# EAGLE design Display Board V1 (EAGLE 9.5.2)
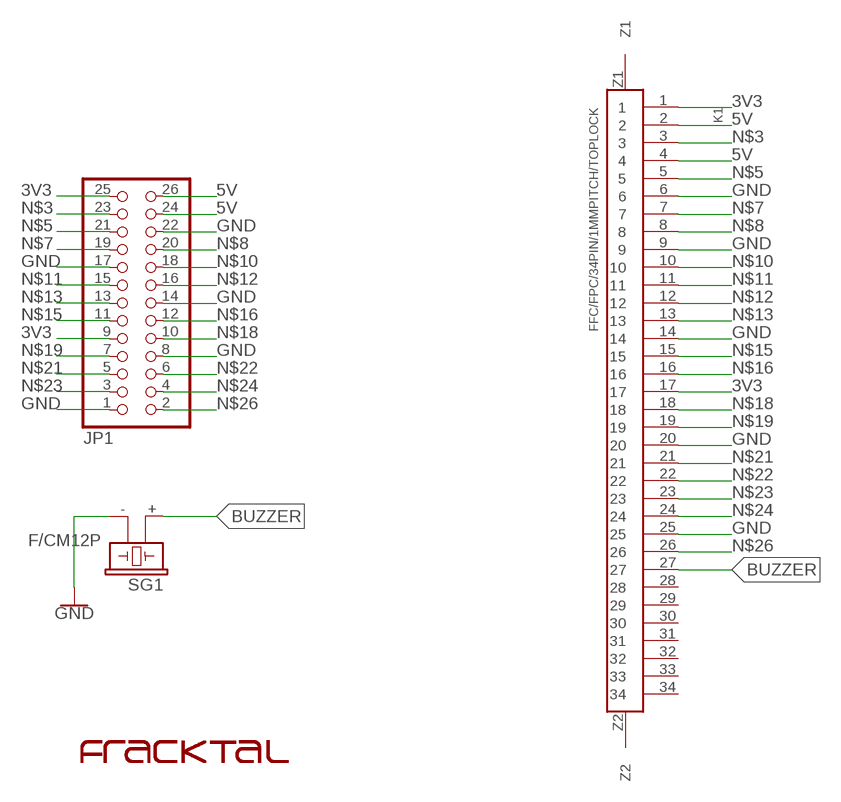
[diagram p0: schematic, sheet 1]

## Parts
JP1  PINHD-2X13  [2X13]
K1  FFC/FPC/34PIN/1MMPITCH/TOPLOCK  [FFC/FPC/34PIN/1MMPITCH/TOPLOCK]
SG1  F/CM12P  [F/CM12P]
U$1  FRACKTALLOGO  [FRACKTALLOGO]

## Nets
3V3: JP1.9 JP1.25 K1.1 K1.17
5V: JP1.24 JP1.26 K1.2 K1.4
BUZZER: K1.27 SG1.+
GND: JP1.1 JP1.8 JP1.14 JP1.17 JP1.22 K1.6 K1.9 K1.14 K1.20 K1.25 SG1.-
N$3: JP1.23 K1.3
N$5: JP1.21 K1.5
N$7: JP1.19 K1.7
N$8: JP1.20 K1.8
N$10: JP1.18 K1.10
N$11: JP1.15 K1.11
N$12: JP1.16 K1.12
N$13: JP1.13 K1.13
N$15: JP1.11 K1.15
N$16: JP1.12 K1.16
N$18: JP1.10 K1.18
N$19: JP1.7 K1.19
N$21: JP1.5 K1.21
N$22: JP1.6 K1.22
N$23: JP1.3 K1.23
N$24: JP1.4 K1.24
N$26: JP1.2 K1.26
Unconnected: K1.28 K1.29 K1.30 K1.31 K1.32 K1.33 K1.34 K1.Z1 K1.Z2

## Library data of the parts
JP1 = pinhead:PINHD-2X13: PIN HEADER
K1 = FracktalWorks:FFC/FPC/34PIN/1MMPITCH/TOPLOCK
SG1 = buzzer:F/CM12P: BUZZER Source: Buerklin; OC_FARNELL: unknown; OC_NEWARK: unknown
U$1 = FracktalWorks_Eagle_Library:FRACKTALLOGO

## Board
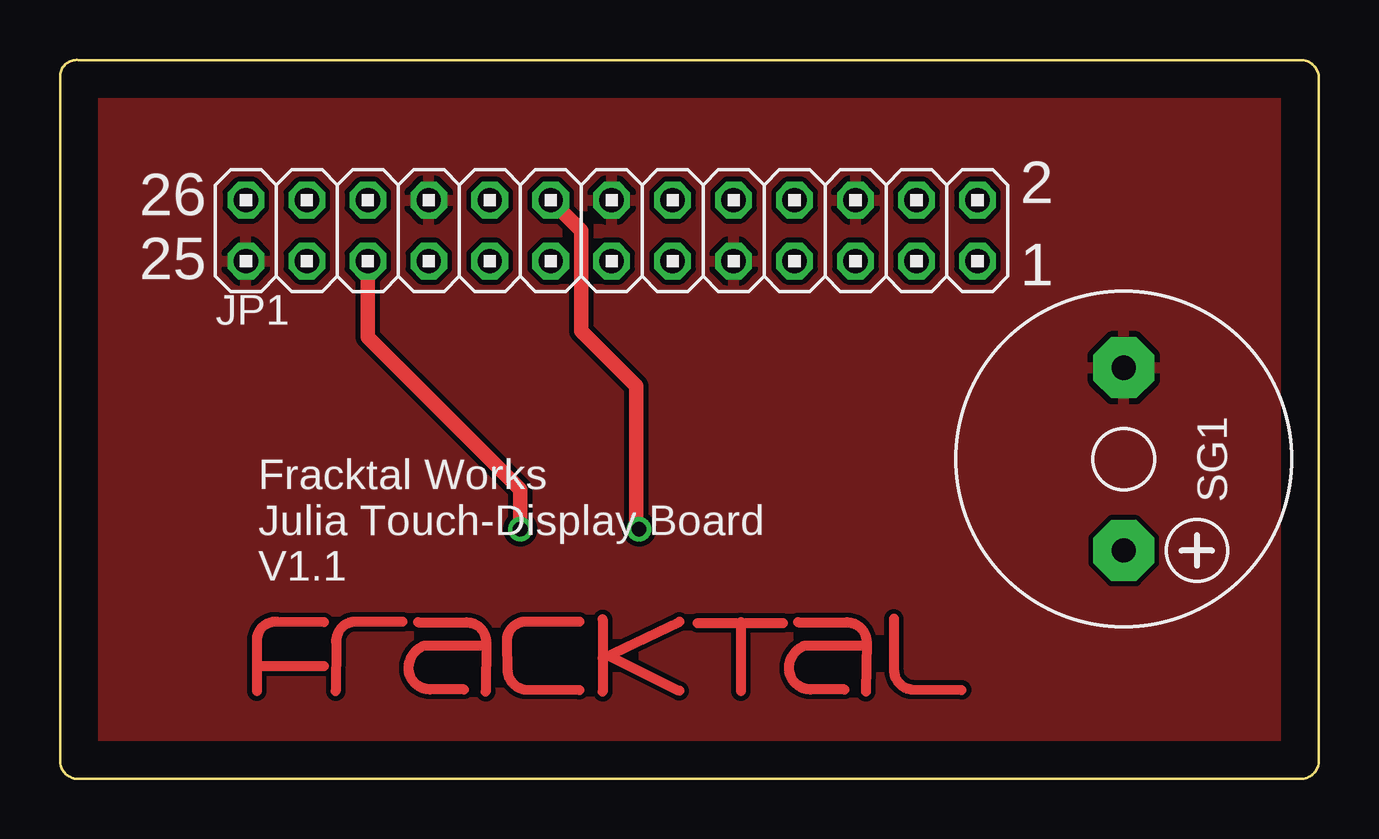
[diagram p1: board, top side]
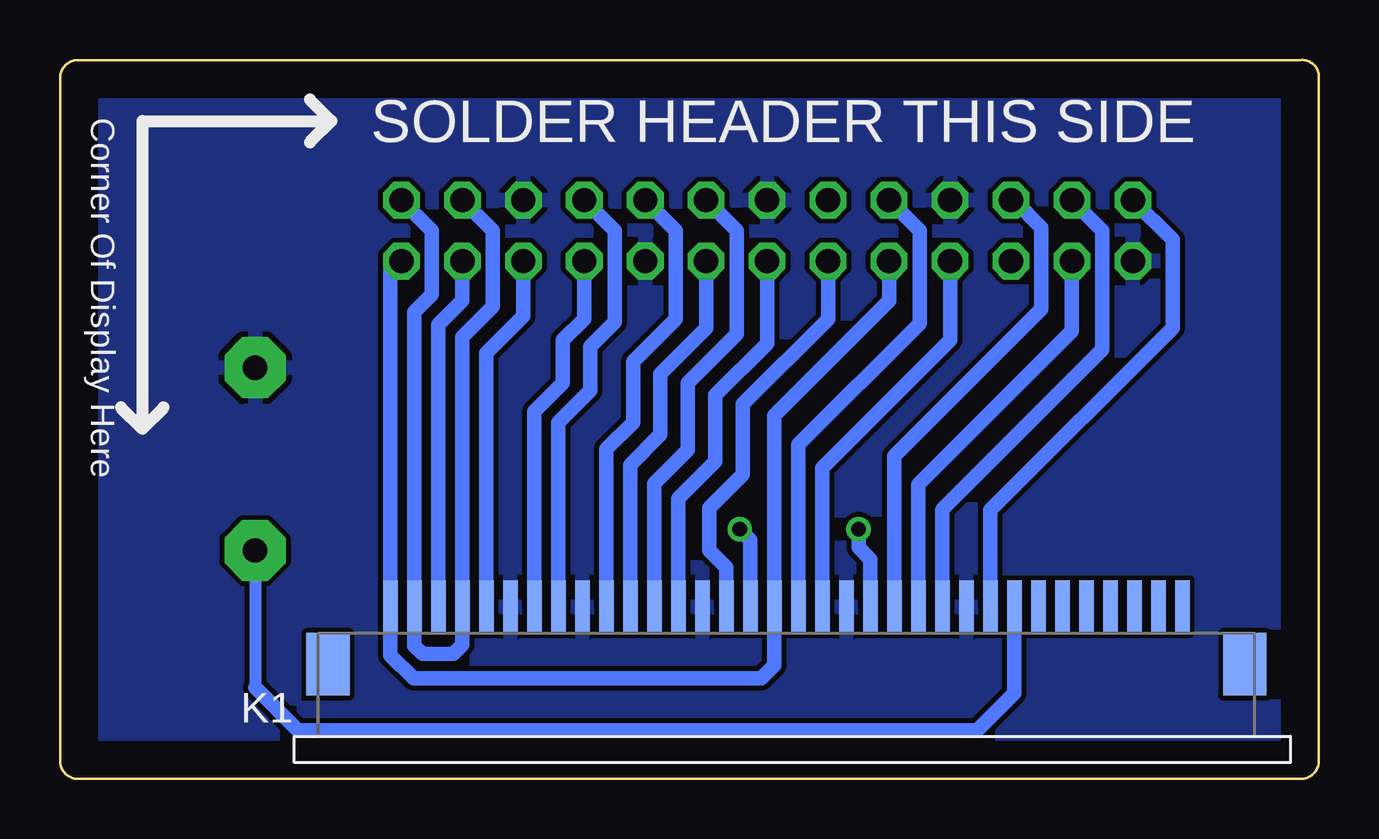
[diagram p2: board, bottom side, seen from below]

Size 52.45 x 29.97 mm. Coordinates in mm from the lower left corner, seen from the top.
Outline: 0,0.76 0,29.34 arc-90 0.76,29.97 51.69,29.97 arc-90 52.45,29.21 52.45,0.76 arc-90 51.69,0 0.76,0 arc-90 0,0.76
Copper layers (1*16): Top 0.035mm / dielectric 1.5mm / Bottom 0.035mm
Design rules "LionCircuits": minimum track width 8mil, minimum drill 0.35mm, track to track 8mil, track to pad 8mil, pad to pad 8mil, via to via 8mil, smd to smd 8mil, copper to edge 60mil, drill to drill 10mil, minimum pad ring 10mil, minimum via ring 8mil, stop-mask expansion 4mil, vias tented up to drill 0mil, thermal gap 10mil

### Footprints (pad centres in the part's own frame; a part is rotated, then mirrored left to right if it is on the bottom)
2X13 = drill 1.016 octagon: 1 -15.24,-1.27; 2 -15.24,1.27; 3 -12.7,-1.27; 4 -12.7,1.27; 5 -10.16,-1.27; 6 -10.16,1.27; 7 -7.62,-1.27; 8 -7.62,1.27; 9 -5.08,-1.27; 10 -5.08,1.27; 11 -2.54,-1.27; 12 -2.54,1.27; 13 0,-1.27; 14 0,1.27; 15 2.54,-1.27; 16 2.54,1.27; 17 5.08,-1.27; 18 5.08,1.27; 19 7.62,-1.27; 20 7.62,1.27; 21 10.16,-1.27; 22 10.16,1.27; 23 12.7,-1.27; 24 12.7,1.27; 25 15.24,-1.27; 26 15.24,1.27
FFC/FPC/34PIN/1MMPITCH/TOPLOCK = smd 0.6 x 2.2: 1 -14.43,2.1; 2 -13.43,2.1; 3 -12.43,2.1; 4 -11.43,2.1; 5 -10.43,2.1; 6 -9.43,2.1; 7 -8.43,2.1; 8 -7.43,2.1; 9 -6.43,2.1; 10 -5.43,2.1; 11 -4.43,2.1; 12 -3.43,2.1; 13 -2.43,2.1; 14 -1.43,2.1; 15 -0.43,2.1; 16 0.57,2.1; 17 1.57,2.1; 18 2.57,2.1; 19 3.57,2.1; 20 4.57,2.1; 21 5.57,2.1; 22 6.57,2.1; 23 7.57,2.1; 24 8.57,2.1; 25 9.57,2.1; 26 10.57,2.1; 27 11.57,2.1; 28 12.57,2.1; 29 13.57,2.1; 30 14.57,2.1; 31 15.57,2.1; 32 16.57,2.1; 33 17.57,2.1; 34 18.57,2.1 | smd 1.8 x 2.6: Z1 -17.03,-0.3; Z2 21.17,-0.3
F/CM12P = drill 1.016 pad 2.54 octagon: + 3.81,0; - -3.81,0

### Placement (x,y rotation side)
JP1  22.99,22.86 0 top
K1  24.26,5.08 0 bottom
SG1  44.32,13.34 270 top
U$1  20.19,3.56 0 top

### Tracks (layer width: path | path; a pad name or v marks a point on that pad's centre or on a via)
3V3
  Bottom 0.61: JP1.25 38.69,21.13 K1.1 38.69,5.16 37.72,4.19 23.24,4.19 22.69,4.75 K1.17 22.69,15.16 17.91,19.94 JP1.9
5V
  Bottom 0.61: JP1.26 36.96,22.86 36.96,20.19 37.69,19.46 K1.2 37.69,5.56 37.34,5.21 36.07,5.21 35.69,5.59 K1.4 35.69,18.41 34.42,19.68 34.42,22.86 JP1.24
BUZZER
  Bottom 0.508: SG1.+ 44.32,3.81
  Bottom 0.61: K1.27 12.69,3.57 14.22,2.03 42.55,2.03 44.32,3.81
GND
  pour Top: 0.25,0.64 0.25,29.34 50.42,29.34 arc-90 51.94,27.81 51.94,2.29 arc-90 50.29,0.64
  pour Bottom: 0.51,0.64 0.51,29.46 51.69,29.46 51.69,0.64
N$3
  Bottom 0.61: K1.3 36.69,18.94 35.69,19.94 JP1.23
N$5
  Bottom 0.61: K1.5 34.69,17.76 33.15,19.3 JP1.21
N$7
  Bottom 0.61: K1.7 32.69,15.32 31.5,16.51 31.5,18.29 30.61,19.18 JP1.19
N$8
  Bottom 0.61: K1.8 31.69,14.86 30.35,16.19 30.35,18.03 29.34,19.05 29.34,22.86 JP1.20
N$10
  Bottom 0.61: JP1.18 26.8,22.86 26.8,19.18 28.57,17.4 28.57,14.86 29.69,13.75 K1.10
N$11
  Bottom 0.61: K1.11 28.69,13.1 27.43,14.35 27.43,16.89 25.53,18.8 JP1.15
N$12
  Bottom 0.61: JP1.16 24.26,22.86 24.26,18.54 26.29,16.51 26.29,13.72 27.69,12.32 K1.12
N$13
  Bottom 0.61: K1.13 26.69,11.68 25.15,13.22 25.15,16 22.99,18.16 JP1.13
N$15
  Bottom 0.61: JP1.11 20.45,19.18 24,15.62 24,12.7 25.4,11.3 25.4,9.53 24.69,8.81 K1.15
N$16  (via drill 0.61)
  Top 0.61: JP1.12 21.72,22.86 21.72,18.67 24,16.38 24,10.54 v24.13,10.41
  Bottom 0.61: K1.16 23.69,9.97 v24.13,10.41
N$18
  Bottom 0.61: K1.18 21.69,13.94 16.64,18.99 16.64,22.86 JP1.10
N$19
  Bottom 0.61: K1.19 20.69,12.97 15.37,18.29 JP1.7
N$21  (via drill 0.61)
  Top 0.61: v19.18,10.41 19.18,12.06 12.83,18.41 JP1.5
  Bottom 0.61: K1.21 18.69,9.16 19.18,9.65 v19.18,10.41
N$22
  Bottom 0.61: K1.22 17.69,13.46 11.56,19.59 11.56,22.99 12.7,24.13 JP1.6
N$23
  Bottom 0.61: K1.23 16.69,12.27 10.29,18.67 JP1.3
N$24
  Bottom 0.61: K1.24 15.69,11.24 9.02,17.91 9.02,22.86 JP1.4
N$26
  Bottom 0.61: K1.26 13.69,11.21 6.1,18.8 6.1,22.48 JP1.2

### Text on the board
tPlace: 26 | 25 | Fracktal Works / Julia Touch-Display Board / V1.1
bPlace: Corner Of Display Here
tNames: 2 | 1
bNames: SOLDER HEADER THIS SIDE
tValues: 26 | 2 | 25 | 1